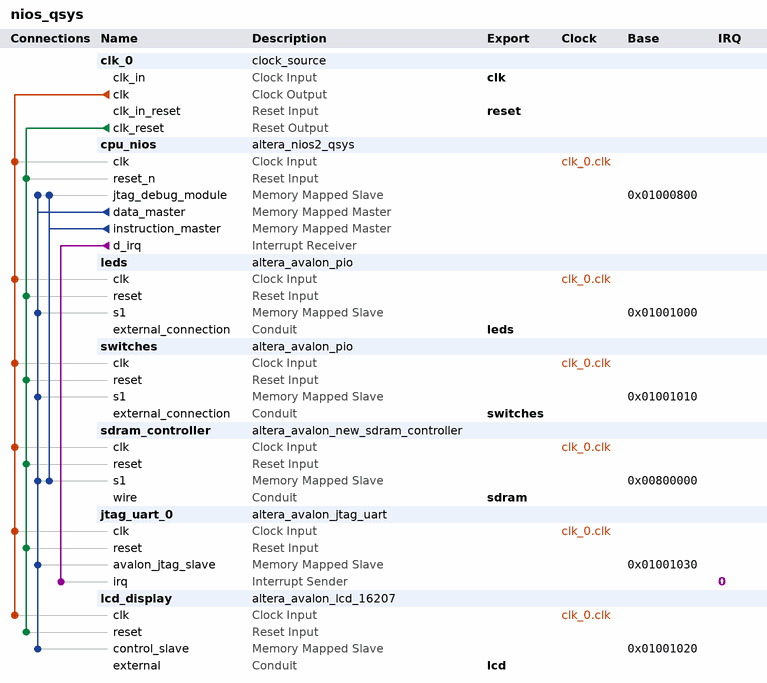
[diagram p0: system contents]
# Platform Designer (Qsys) system nios_qsys
# Parameters at their usual value, and those the tool derives, are not listed.
package require -exact qsys 11.0
create_system nios_qsys
set_project_property DEVICE_FAMILY CYCLONEII

add_instance clk_0 clock_source 11.0
set_instance_parameter_value clk_0 clockFrequency 50000000

add_instance cpu_nios altera_nios2_qsys 11.0
set_instance_parameter_value cpu_nios manuallyAssignCpuID false
set_instance_parameter_value cpu_nios resetSlave sdram_controller.s1
set_instance_parameter_value cpu_nios exceptionSlave sdram_controller.s1
set_instance_parameter_value cpu_nios breakSlave cpu_nios.jtag_debug_module
set_instance_parameter_value cpu_nios impl Small
set_instance_parameter_value cpu_nios icache_size 4096

add_instance leds altera_avalon_pio 11.0
set_instance_parameter_value leds direction Output
set_instance_parameter_value leds width 18

add_instance switches altera_avalon_pio 11.0
set_instance_parameter_value switches direction Input
set_instance_parameter_value switches width 18

add_instance sdram_controller altera_avalon_new_sdram_controller 11.0
set_instance_parameter_value sdram_controller TAC 5.5
set_instance_parameter_value sdram_controller TRCD 20.0
set_instance_parameter_value sdram_controller TRP 20.0
set_instance_parameter_value sdram_controller casLatency 3
set_instance_parameter_value sdram_controller columnWidth 8
set_instance_parameter_value sdram_controller dataWidth 16
set_instance_parameter_value sdram_controller generateSimulationModel true
set_instance_parameter_value sdram_controller model custom
set_instance_parameter_value sdram_controller numberOfBanks 4
set_instance_parameter_value sdram_controller numberOfChipSelects 1
set_instance_parameter_value sdram_controller powerUpDelay 100.0
set_instance_parameter_value sdram_controller refreshPeriod 15.625
set_instance_parameter_value sdram_controller rowWidth 12

add_instance jtag_uart_0 altera_avalon_jtag_uart 11.0
set_instance_parameter_value jtag_uart_0 simInteractiveOptions INTERACTIVE_ASCII_OUTPUT

add_instance lcd_display altera_avalon_lcd_16207 11.0

# connections
add_connection clk_0.clk cpu_nios.clk clock
add_connection clk_0.clk jtag_uart_0.clk clock
add_connection clk_0.clk lcd_display.clk clock
add_connection clk_0.clk leds.clk clock
add_connection clk_0.clk sdram_controller.clk clock
add_connection clk_0.clk switches.clk clock
add_connection clk_0.clk_reset cpu_nios.reset_n reset
add_connection clk_0.clk_reset jtag_uart_0.reset reset
add_connection clk_0.clk_reset lcd_display.reset reset
add_connection clk_0.clk_reset leds.reset reset
add_connection clk_0.clk_reset sdram_controller.reset reset
add_connection clk_0.clk_reset switches.reset reset
add_connection cpu_nios.data_master cpu_nios.jtag_debug_module avalon
set_connection_parameter_value cpu_nios.data_master/cpu_nios.jtag_debug_module baseAddress 0x01000800
add_connection cpu_nios.data_master jtag_uart_0.avalon_jtag_slave avalon
set_connection_parameter_value cpu_nios.data_master/jtag_uart_0.avalon_jtag_slave baseAddress 0x01001030
add_connection cpu_nios.data_master lcd_display.control_slave avalon
set_connection_parameter_value cpu_nios.data_master/lcd_display.control_slave baseAddress 0x01001020
add_connection cpu_nios.data_master leds.s1 avalon
set_connection_parameter_value cpu_nios.data_master/leds.s1 baseAddress 0x01001000
add_connection cpu_nios.data_master sdram_controller.s1 avalon
set_connection_parameter_value cpu_nios.data_master/sdram_controller.s1 baseAddress 0x00800000
add_connection cpu_nios.data_master switches.s1 avalon
set_connection_parameter_value cpu_nios.data_master/switches.s1 baseAddress 0x01001010
add_connection cpu_nios.instruction_master cpu_nios.jtag_debug_module avalon
set_connection_parameter_value cpu_nios.instruction_master/cpu_nios.jtag_debug_module baseAddress 0x01000800
add_connection cpu_nios.instruction_master sdram_controller.s1 avalon
set_connection_parameter_value cpu_nios.instruction_master/sdram_controller.s1 baseAddress 0x00800000
add_connection cpu_nios.d_irq jtag_uart_0.irq interrupt
set_connection_parameter_value cpu_nios.d_irq/jtag_uart_0.irq irqNumber 0

# exported interfaces
add_interface clk clock sink
set_interface_property clk EXPORT_OF clk_0.clk_in
add_interface reset reset sink
set_interface_property reset EXPORT_OF clk_0.clk_in_reset
add_interface leds conduit end
set_interface_property leds EXPORT_OF leds.external_connection
add_interface switches conduit end
set_interface_property switches EXPORT_OF switches.external_connection
add_interface sdram conduit end
set_interface_property sdram EXPORT_OF sdram_controller.wire
add_interface lcd conduit end
set_interface_property lcd EXPORT_OF lcd_display.external

save_system nios_qsys.qsys
